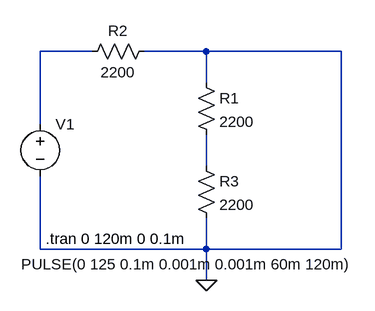
[diagram p0: schematic scheme_before_connection.asc]
scheme_before_connection.asc, the LTspice schematic file:
Version 4
SHEET 1 1008 680
WIRE 304 -128 224 -128
WIRE 480 -128 384 -128
WIRE 688 -128 480 -128
WIRE 480 -80 480 -128
WIRE 224 -16 224 -128
WIRE 480 48 480 0
WIRE 224 176 224 64
WIRE 480 176 480 128
WIRE 480 176 224 176
WIRE 688 176 688 -128
WIRE 688 176 480 176
WIRE 480 224 480 176
FLAG 480 224 0
SYMBOL voltage 224 -32 R0
WINDOW 123 0 0 Left 0
WINDOW 39 0 0 Left 0
WINDOW 3 484 231 Right 2
SYMATTR InstName V1
SYMATTR Value PULSE(0 125 0.1m 0.001m 0.001m 60m 120m)
SYMBOL res 400 -144 R90
WINDOW 0 0 56 VBottom 2
WINDOW 3 32 56 VTop 2
SYMATTR InstName R2
SYMATTR Value 2200
SYMBOL res 464 -96 R0
SYMATTR InstName R1
SYMATTR Value 2200
SYMBOL res 464 32 R0
SYMATTR InstName R3
SYMATTR Value 2200
TEXT 232 160 Left 2 !.tran 0 120m 0 0.1m

The netlist it stands for:
* scheme_before_connection.asc
V1 N001 0 PULSE(0 125 0.1m 0.001m 0.001m 60m 120m)
R2 0 N001 2200
R1 0 N002 2200
R3 N002 0 2200
.tran 0 120m 0 0.1m
.backanno
.end